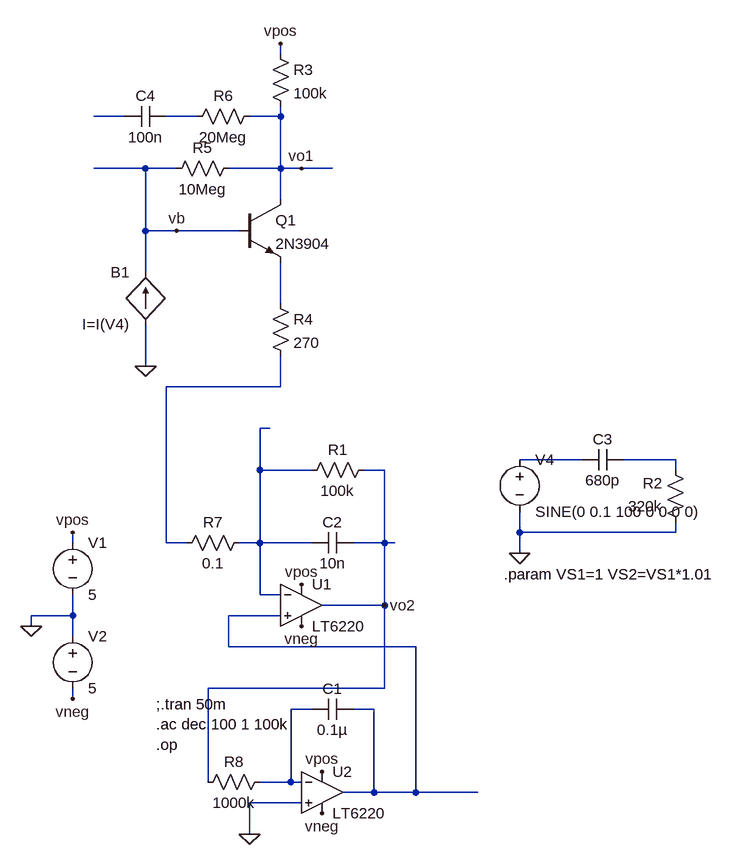
[diagram p0: schematic esf_op-amp_BJT.asc]
esf_op-amp_BJT.asc, the LTspice schematic file:
Version 4
SHEET 1 996 680
WIRE 176 -656 176 -672
WIRE -64 -560 -112 -560
WIRE 48 -560 0 -560
WIRE 176 -560 176 -576
WIRE 176 -560 128 -560
WIRE -32 -480 -112 -480
WIRE 16 -480 -32 -480
WIRE 176 -480 176 -560
WIRE 176 -480 96 -480
WIRE 208 -480 176 -480
WIRE 256 -480 208 -480
WIRE 176 -432 176 -480
WIRE -32 -384 -32 -480
WIRE 16 -384 -32 -384
WIRE 112 -384 16 -384
WIRE -32 -320 -32 -384
WIRE 176 -272 176 -336
WIRE -32 -176 -32 -240
WIRE 176 -144 176 -192
WIRE 176 -144 0 -144
WIRE 160 -80 144 -80
WIRE 640 -32 544 -32
WIRE 784 -32 704 -32
WIRE 144 -16 144 -80
WIRE 224 -16 144 -16
WIRE 336 -16 304 -16
WIRE 784 -16 784 -32
WIRE 544 80 544 48
WIRE 784 80 784 64
WIRE 784 80 544 80
WIRE -144 96 -144 80
WIRE 0 96 0 -144
WIRE 32 96 0 96
WIRE 144 96 144 -16
WIRE 144 96 112 96
WIRE 224 96 144 96
WIRE 336 96 336 -16
WIRE 336 96 288 96
WIRE 352 96 336 96
WIRE 544 112 544 80
WIRE 144 176 144 96
WIRE 176 176 144 176
WIRE 336 192 336 96
WIRE 336 192 240 192
WIRE -144 208 -144 176
WIRE -144 208 -208 208
WIRE 176 208 96 208
WIRE -208 224 -208 208
WIRE -144 240 -144 208
WIRE 96 256 96 208
WIRE 384 256 96 256
WIRE 336 320 336 192
WIRE 336 320 64 320
WIRE -144 336 -144 320
WIRE 224 352 192 352
WIRE 320 352 288 352
WIRE 64 464 64 320
WIRE 192 464 192 352
WIRE 192 464 144 464
WIRE 208 464 192 464
WIRE 320 480 320 352
WIRE 320 480 272 480
WIRE 384 480 384 256
WIRE 384 480 320 480
WIRE 480 480 384 480
WIRE 208 496 128 496
WIRE 128 544 128 496
FLAG -208 224 0
FLAG -144 80 vpos
FLAG -144 336 vneg
FLAG 208 224 vneg
FLAG 208 160 vpos
FLAG 544 112 0
FLAG 208 -480 vo1
FLAG 16 -384 vb
FLAG -32 -176 0
FLAG 176 -672 vpos
FLAG 336 192 vo2
FLAG 240 512 vneg
FLAG 240 448 vpos
FLAG 128 544 0
DATAFLAG 256 -480 "$"
DATAFLAG 160 -80 "$"
DATAFLAG 352 96 "$"
DATAFLAG 352 96 "$"
DATAFLAG 464 480 "$"
SYMBOL voltage -144 80 R0
SYMATTR InstName V1
SYMATTR Value 5
SYMBOL voltage -144 224 R0
SYMATTR InstName V2
SYMATTR Value 5
SYMBOL Cap 288 80 R90
WINDOW 0 0 32 VBottom 2
WINDOW 3 32 32 VTop 2
SYMATTR InstName C2
SYMATTR Value 10n
SYMBOL Res 800 80 R180
WINDOW 0 36 76 Left 2
WINDOW 3 36 40 Left 2
SYMATTR InstName R2
SYMATTR Value 320k
SYMBOL Cap 704 -48 R90
WINDOW 0 0 32 VBottom 2
WINDOW 3 32 32 VTop 2
SYMATTR InstName C3
SYMATTR Value 680p
SYMBOL voltage 544 -48 R0
SYMATTR InstName V4
SYMATTR Value SINE(0 0.1 100 0 0 0 0)
SYMATTR Value2 AC 1
SYMBOL npn 112 -432 R0
SYMATTR InstName Q1
SYMATTR Value 2N3904
SYMBOL Res 160 -672 R0
SYMATTR InstName R3
SYMATTR Value 100k
SYMBOL Res 160 -288 R0
SYMATTR InstName R4
SYMATTR Value 270
SYMBOL Res 112 -496 R90
WINDOW 0 0 56 VBottom 2
WINDOW 3 32 56 VTop 2
SYMATTR InstName R5
SYMATTR Value 10Meg
SYMBOL Cap 0 -576 R90
WINDOW 0 0 32 VBottom 2
WINDOW 3 32 32 VTop 2
SYMATTR InstName C4
SYMATTR Value 100n
SYMBOL Res 144 -576 R90
WINDOW 0 0 56 VBottom 2
WINDOW 3 32 56 VTop 2
SYMATTR InstName R6
SYMATTR Value 20Meg
SYMBOL bi -32 -240 R180
WINDOW 0 24 80 Left 2
WINDOW 3 24 0 Left 2
SYMATTR InstName B1
SYMATTR Value I=I(V4)
SYMBOL Res 128 80 R90
WINDOW 0 0 56 VBottom 2
WINDOW 3 32 56 VTop 2
SYMATTR InstName R7
SYMATTR Value 0.1
SYMBOL Res 320 -32 R90
WINDOW 0 0 56 VBottom 2
WINDOW 3 32 56 VTop 2
SYMATTR InstName R1
SYMATTR Value 100k
SYMBOL OpAmps/LT6220 208 192 R0
SYMATTR InstName U1
SYMBOL OpAmps/LT6220 240 480 R0
SYMATTR InstName U2
SYMBOL Res 160 448 R90
WINDOW 0 0 56 VBottom 2
WINDOW 3 32 56 VTop 2
SYMATTR InstName R8
SYMATTR Value 1000k
SYMBOL Cap 288 336 R90
WINDOW 0 0 32 VBottom 2
WINDOW 3 32 32 VTop 2
SYMATTR InstName C1
SYMATTR Value 0.1µ
TEXT -16 344 Left 2 !;.tran 50m\n.ac dec 100 1 100k\n.op
TEXT 520 144 Left 2 !.param VS1=1 VS2=VS1*1.01

The netlist it stands for:
* esf_op-amp_BJT.asc
V1 vpos 0 5
V2 0 vneg 5
C2 vo2 N005 10n
R2 0 N007 320k
C3 N007 N006 680p
V4 N006 0 SINE(0 0.1 100 0 0 0 0) AC 1
Q1 vo1 vb N003 0 2N3904
R3 vpos vo1 100k
R4 N003 N004 270
R5 vo1 vb 10Meg
C4 N002 N001 100n
R6 vo1 N002 20Meg
B1 0 vb I=I(V4)
R7 N005 N004 0.1
R1 vo2 N005 100k
XU1 N008 N005 vpos vneg vo2 LT6220  ; pins In+ In- V+ V- OUT
XU2 0 N009 vpos vneg N008 LT6220  ; pins In+ In- V+ V- OUT
R8 N009 vo2 1000k
C1 N008 N009 0.1µ
.model NPN NPN
.model PNP PNP
.lib standard.bjt
;.tran 50m
.ac dec 100 1 100k
.op
.param VS1=1 VS2=VS1*1.01
.lib LTC4.lib
.backanno
.end